# Altium schematic sheet SHDN-S09-V00-Buzzer.SchDoc: Alarm Buzzer (4kHz)
size A3; DrawnBy: Jonn Dillon; DocumentNumber: 8; SheetNumber: 8; SheetTotal: 11; Project: Shutdown Board 2020
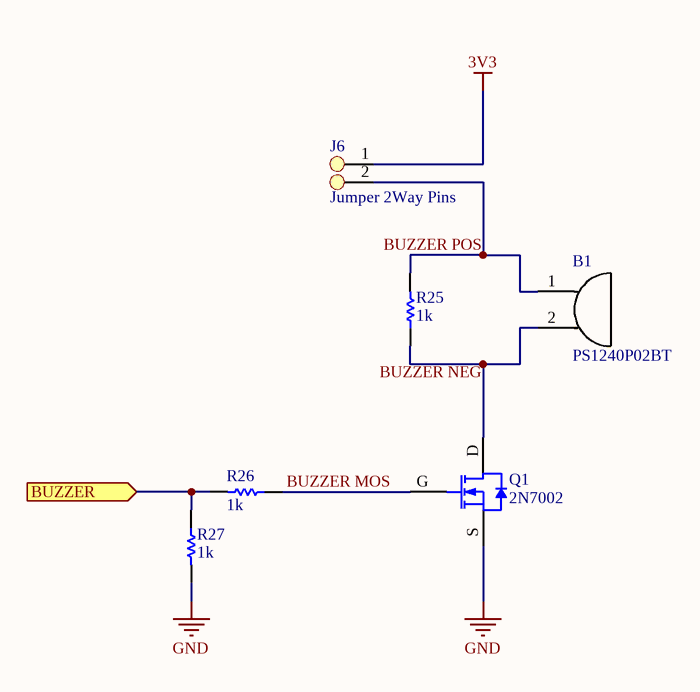
[diagram p0: SHDN-S09-V00-Buzzer.SchDoc]

## Parts
B1  PS1240P02BT  [PS1240P02BT]
J6  Jumper 2Way Pins  [Jumper_2Way_Pin]
Q1  2N7002  [SOT23-3]
R25  1k  [Res_ThinFilm_0603]
R26  1k  [Res_ThinFilm_0603]
R27  1k  [Res_ThinFilm_0603]

## Ports
BUZZER (in)

## Nets
3V3: J6.1
GND: Q1.S R27.2
BUZZER: R26.2 R27.1 ; port BUZZER
BUZZER MOS: Q1.G R26.1
BUZZER NEG: B1.2 Q1.D R25.1
BUZZER POS: B1.1 J6.2 R25.2

## Notes on the sheet
- Revision History:
- Sheet Title:
- Rev
- Date
- Description
- Project:
- Size:
- Drawn By:
- A3
- Number:
- Revision:
- Sheet
- Version:
- of
- QUT Motorsport
- O-120, Gardens Point
- 2 George Street
- Brisbane, QLD 4000
- Australia
- Print Date:
- Print Time:
- File Name:

## Library data of the parts
B1 = PS1240P02BT: Buzzers Transducer, Externally Driven Piezo 3V 4kHz 60dB @ 3V, 10cm Through Hole PC Pins
J6 = Jumper 2Way Side Pins
R25-R27 = 1k 5% 0603: Resistor, SMD, 1k, 0.1W, 5%, 0603